# EasyEDA Pro project PCB.eprj, board Flags_Register
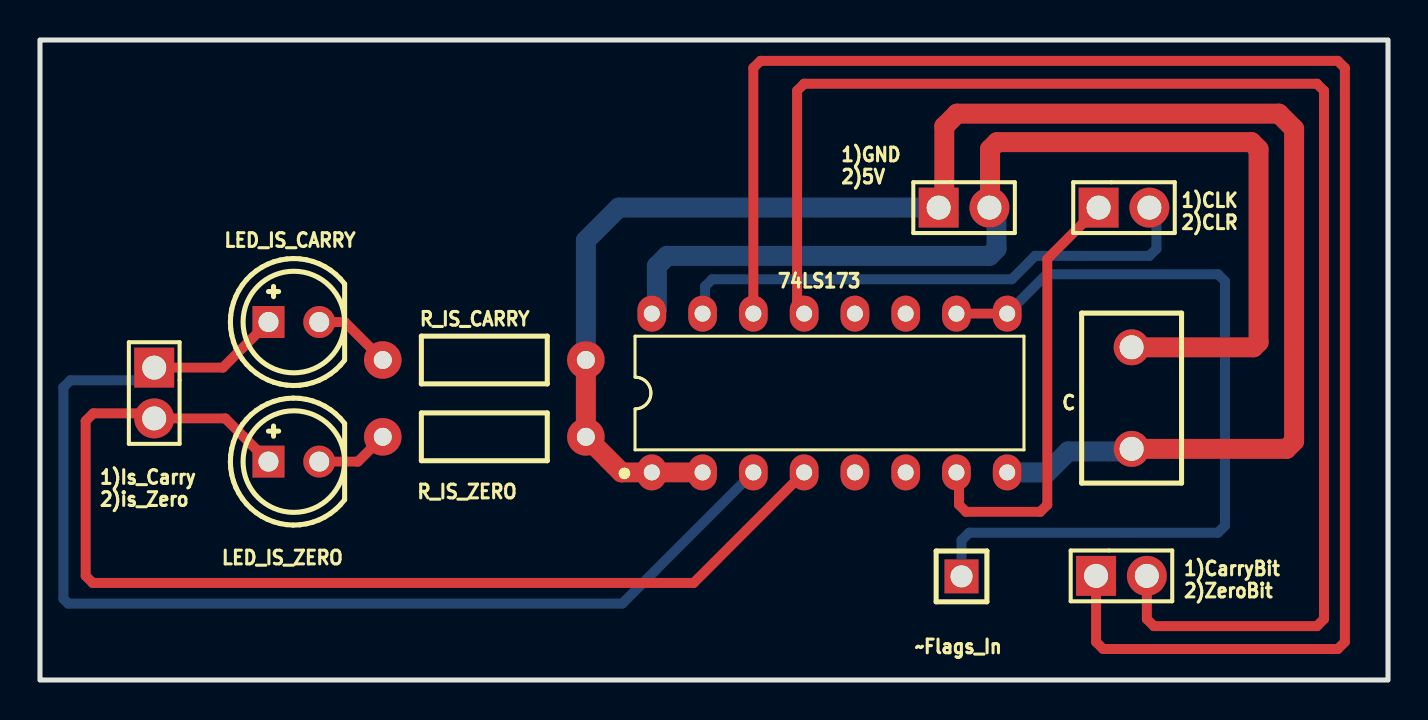
[diagram p10: board, top side]
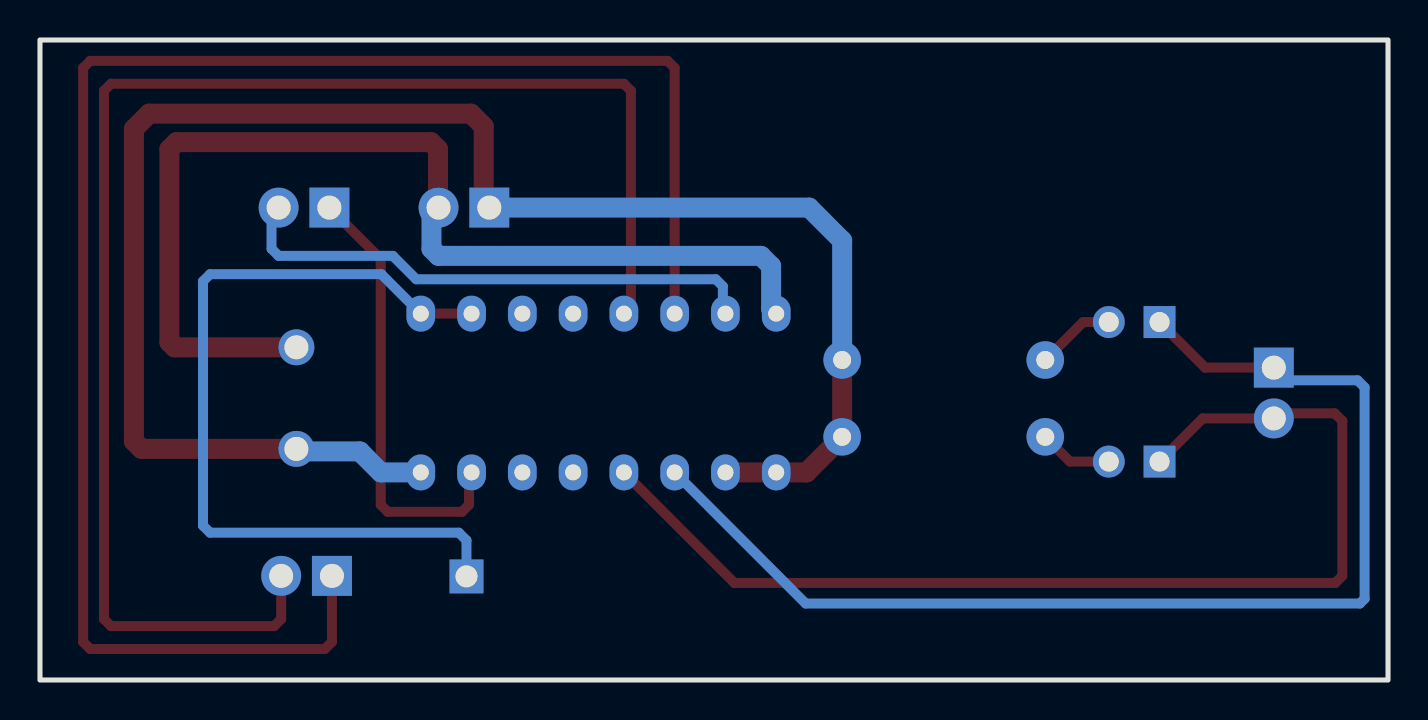
[diagram p11: board, bottom side, seen from below]

Outline 67.44 x 32 mm; copper layers: Top Layer, Bottom Layer. Coordinates in mm from the lower left corner of the outline.
Outline path: rectangle 0,32 67.44,0
Stack: Top Layer 0.035mm / Dielectric1 1.51mm FR4 er 4.5 / Bottom Layer 0.035mm

## Design rules (mm)
template: Custom Config
spacing copperThickness1oz (default): track to track 0.102, other pairs 0.152 to 0.3
spacing copperThickness2oz: track to track 0.203, other pairs 0.152 to 0.3
track width copperThickness1oz (default): min 0.127, default 0.5, max 2.54
track width copperThickness2oz: min 0.203, default 0.254, max 2.54
differential pair differentialPair (default): width min 0.127, default 0.254, max 2.54; gap min 0.152, default 0.152
via viaSize (default): diameter min 0.5, default 0.61, max 10; hole min 0.3, default 0.305, max 6.3

## Placement (name value [footprint] x y rotation side)
1)CarryBit
2)ZeroBit  PZ254V-11-02P  [HDR-TH_2P-P2.54-V-M]  54.1 5.21 0 top
1)CLK
2)CLR  PZ254V-11-02P  [HDR-TH_2P-P2.54-V-M]  54.23 23.62 0 top
1)GND
2)5V  PZ254V-11-02P  [HDR-TH_2P-P2.54-V-M]  46.23 23.62 0 top
1)Is_Carry
2)is_Zero  PZ254V-11-02P  [HDR-TH_2P-P2.54-V-M]  5.72 14.35 270 top
74LS173  SN74LS173AN  [PDIP-16_L19.3-W6.4-P2.54-LS7.94-BL]  39.5 14.35 0 top
C  100nF  [CAP-TH_L8.5-W5.0-P5.00-D1.2]  54.61 14.1 90 top
LED_IS_CARRY  -  [LED-TH_BD5.8-P2.54-FD]  12.7 17.9 0 top
LED_IS_ZERO  -  [LED-TH_BD5.8-P2.54-FD]  12.7 10.92 0 top
R_IS_CARRY  220Ω  [R_AXIAL-0.4]  22.23 16 0 top
R_IS_ZERO  220Ω  [R_AXIAL-0.4]  22.23 12.16 0 top
~Flags_In  PZ254V-11-01P  [HDR-TH_1P-P2.54-V-M]  46.1 5.18 0 top

## Footprints (pads in the part's own frame, mm; a bottom-side part is the same pattern mirrored in y, then rotated)
CAP-TH_L8.5-W5.0-P5.00-D1.2
  round 1.8 hole 1.2: 1(-2.54,0) 2(2.54,0)
HDR-TH_1P-P2.54-V-M
  rect 1.7x1.7 hole 1.1: 1(0,0)
HDR-TH_2P-P2.54-V-M
  rect 2x2 hole 1.2: 1(-1.27,0)
  round 2 hole 1.2: 2(1.27,0)
LED-TH_BD5.8-P2.54-FD
  rect 1.6x1.6 hole 1: 1(-1.27,0)
  round 1.6 hole 1: 2(1.27,0)
PDIP-16_L19.3-W6.4-P2.54-LS7.94-BL
  oval 1.44x1.8 hole 0.8: 1(-8.89,-3.97) 2(-6.35,-3.97) 3(-3.81,-3.97) 4(-1.27,-3.97) 5(1.27,-3.97) 6(3.81,-3.97) 7(6.35,-3.97) 8(8.89,-3.97) 9(8.89,3.97) 10(6.35,3.97) 11(3.81,3.97) 12(1.27,3.97) 13(-1.27,3.97) 14(-3.81,3.97) 15(-6.35,3.97) 16(-8.89,3.97)
R_AXIAL-0.4
  round 1.879 hole 0.899: 1(-5.08,0) 2(5.08,0)

## Nets
As in the schematic.

Pads without a net: 74LS173 5 6 11 12

## Routing (per net, layer and track width the routed paths; a pad name or vN(x,y) marks a point on that pad's centre or on a via; arc(x,y) is an arc through that point)
+5V: length 54.8
  Top Layer w1: C.2 60.71,16.64 60.96,16.89 60.96,26.54 60.61,26.9 47.88,26.9 47.53,26.54 47.53,23.65 1)GND
2)5V.2
  Bottom Layer w1: 1)GND
2)5V.2 47.85,23.27 47.85,21.56 47.5,21.21 31.37,21.21 30.86,20.7 30.86,18.58 74LS173.16
GND: length 87.6
  Top Layer w1: C.1 62.36,11.56 62.74,11.94 62.74,27.56 61.98,28.32 45.87,28.32 45.24,27.69 45.24,23.9 1)GND
2)5V.1 ; R_IS_CARRY.2 R_IS_ZERO.2 29.09,10.38 74LS173.1 74LS173.2
  Bottom Layer w1: R_IS_CARRY.2 27.31,21.97 28.96,23.62 1)GND
2)5V.1 ; 74LS173.8 50.39,10.38 51.44,11.43 54.48,11.43 C.1
CARRY_BIT: length 86.9
  Top Layer w0.5: 1)CarryBit
2)ZeroBit.1 52.83,1.91 53.19,1.55 64.92,1.55 65.28,1.91 65.28,30.61 64.92,30.96 36.04,30.96 35.69,30.61 74LS173.14
CLK: length 22.3
  Top Layer w0.5: 74LS173.7 45.97,10.25 45.97,8.76 46.33,8.41 50.04,8.41 50.39,8.76 50.39,21.05 1)CLK
2)CLR.1
CLR: length 27
  Bottom Layer w0.5: 74LS173.15 33.27,18.45 33.27,19.69 33.63,20.04 48.61,20.04 49.78,21.21 55.5,21.21 55.85,21.56 55.85,23.27 1)CLK
2)CLR.2
IS_CARRY: length 59.5
  Top Layer w0.5: LED_IS_CARRY.1 9.15,15.62 1)Is_Carry
2)is_Zero.1
  Bottom Layer w0.5: 1)Is_Carry
2)is_Zero.1 5.08,14.99 1.52,14.99 1.17,14.63 1.17,4.06 1.41,3.82 29.13,3.82 74LS173.3
IS_ZERO: length 56.4
  Top Layer w0.5: LED_IS_ZERO.1 9.27,13.08 1)Is_Carry
2)is_Zero.2 5.46,13.34 2.67,13.34 2.29,12.95 2.29,5.21 2.64,4.85 32.7,4.85 74LS173.4
ZERO_BIT: length 75.7
  Top Layer w0.5: 74LS173.13 37.87,18.67 37.87,29.46 38.23,29.82 63.88,29.82 64.23,29.46 64.23,3.05 63.88,2.69 55.73,2.69 55.37,3.05 1)CarryBit
2)ZeroBit.2
~FLAGS_IN: length 41.9
  Top Layer w0.5: 74LS173.10 74LS173.9
  Bottom Layer w0.5: 74LS173.9 50.36,20.29 58.93,20.29 59.28,19.94 59.28,7.72 58.93,7.37 46.48,7.37 46.1,6.98 ~Flags_In.1
$1N333: length 3.7
  Top Layer w0.5: R_IS_ZERO.1 15.91,10.92 LED_IS_ZERO.2
$1N334: length 4
  Top Layer w0.5: LED_IS_CARRY.2 15.25,17.9 R_IS_CARRY.1
